# EasyEDA Pro project ProPrj_火车手动控制开关_2025-05-28.epro, board PCB1
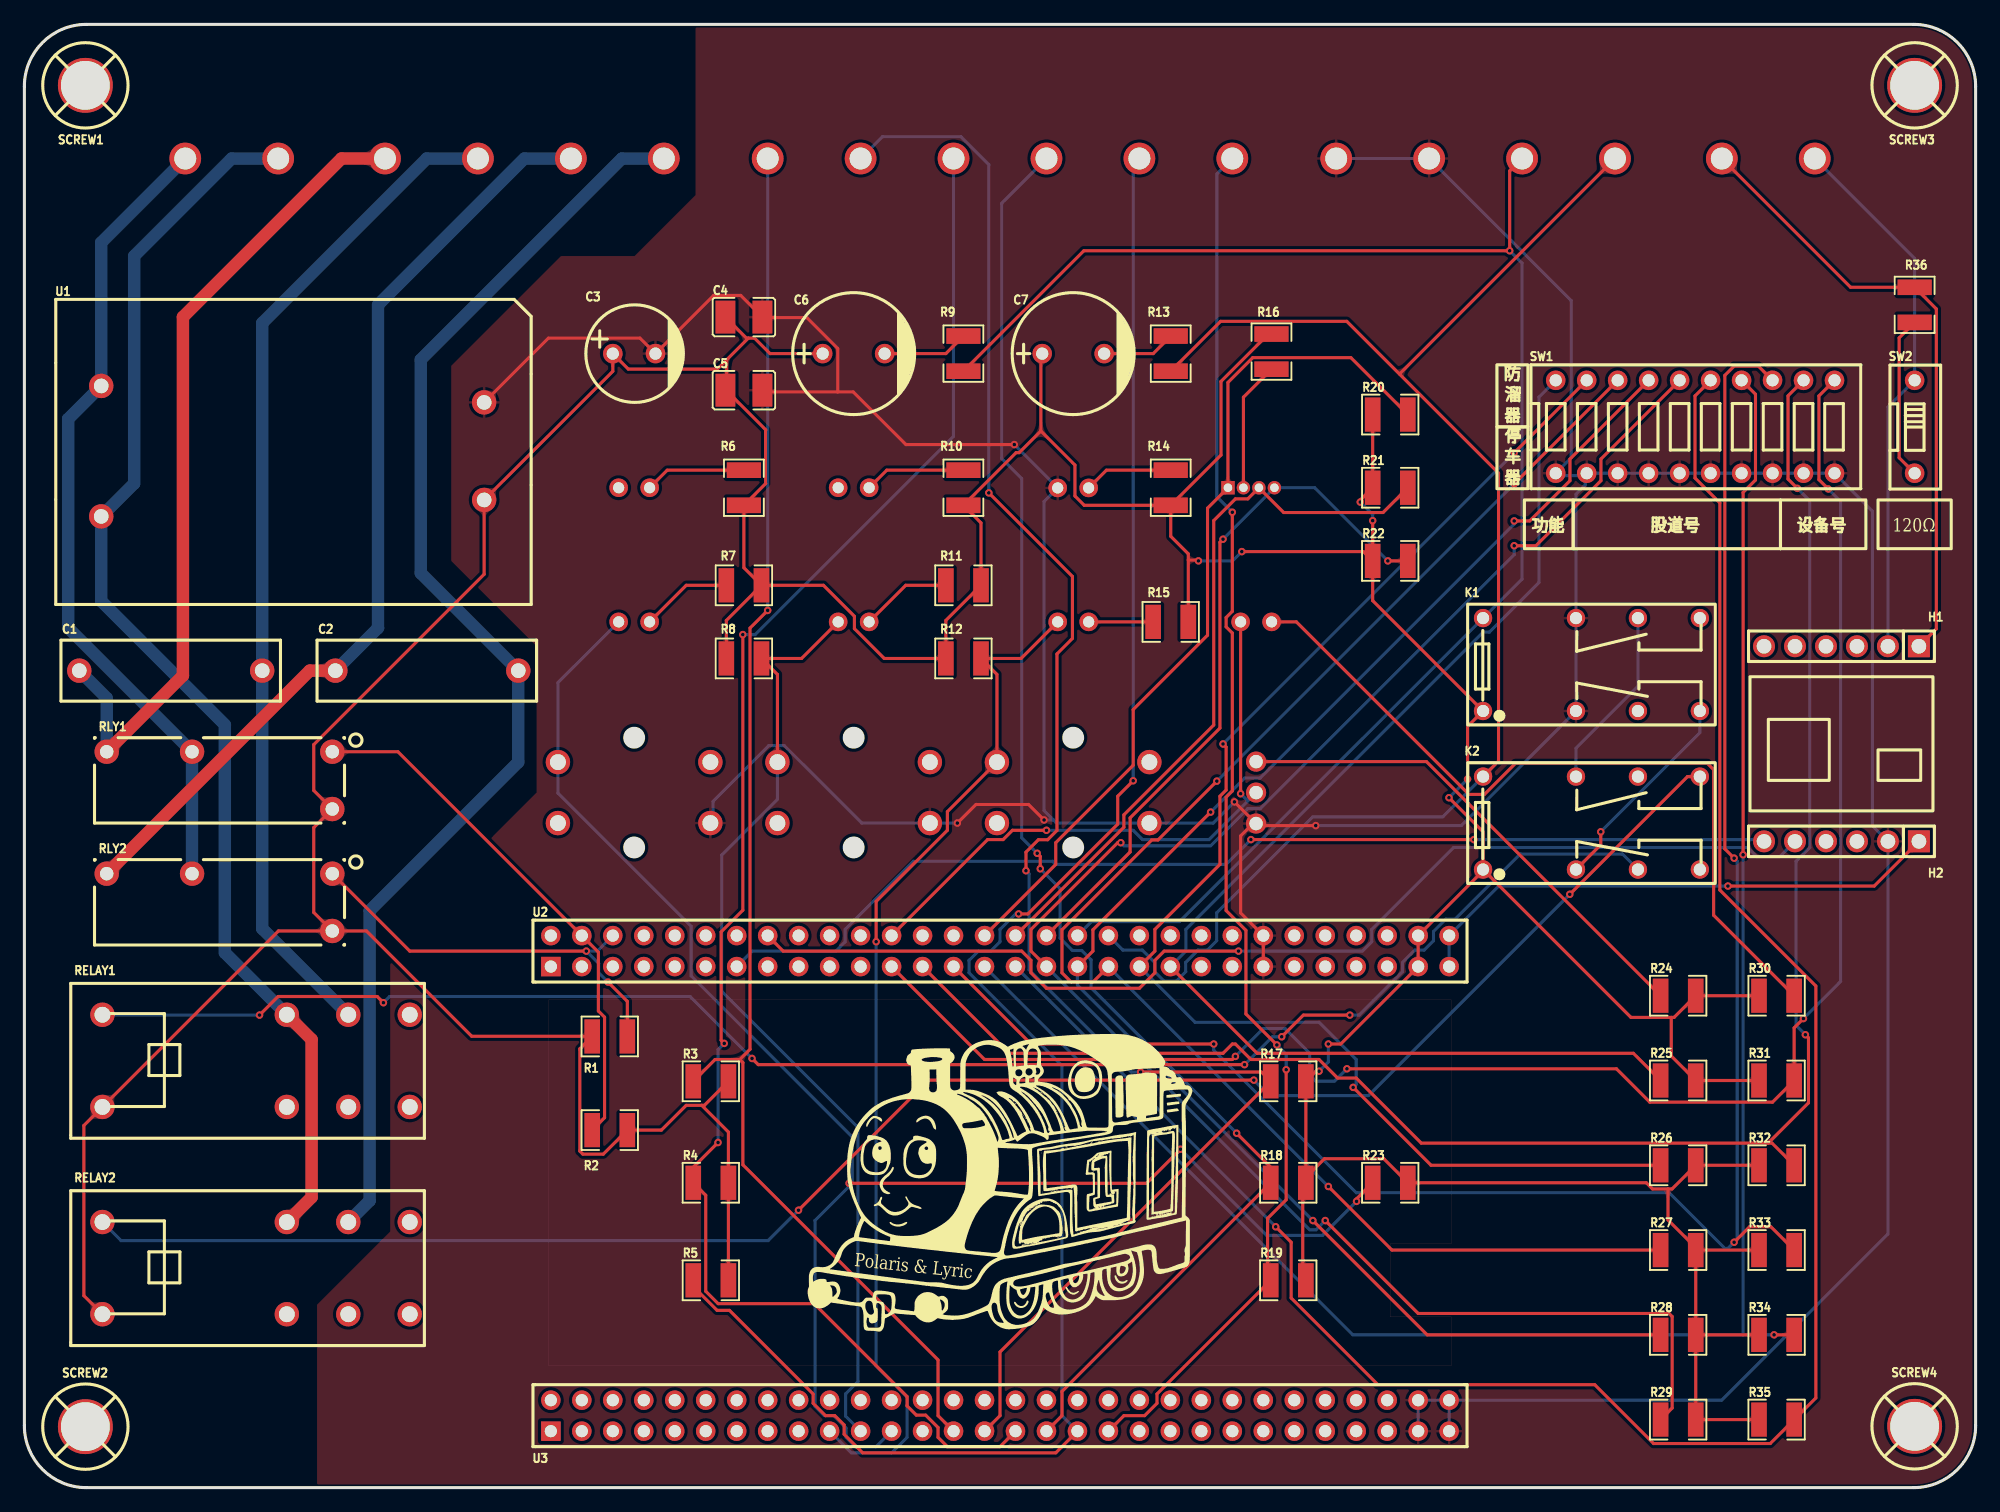
[diagram p3: board, top side]
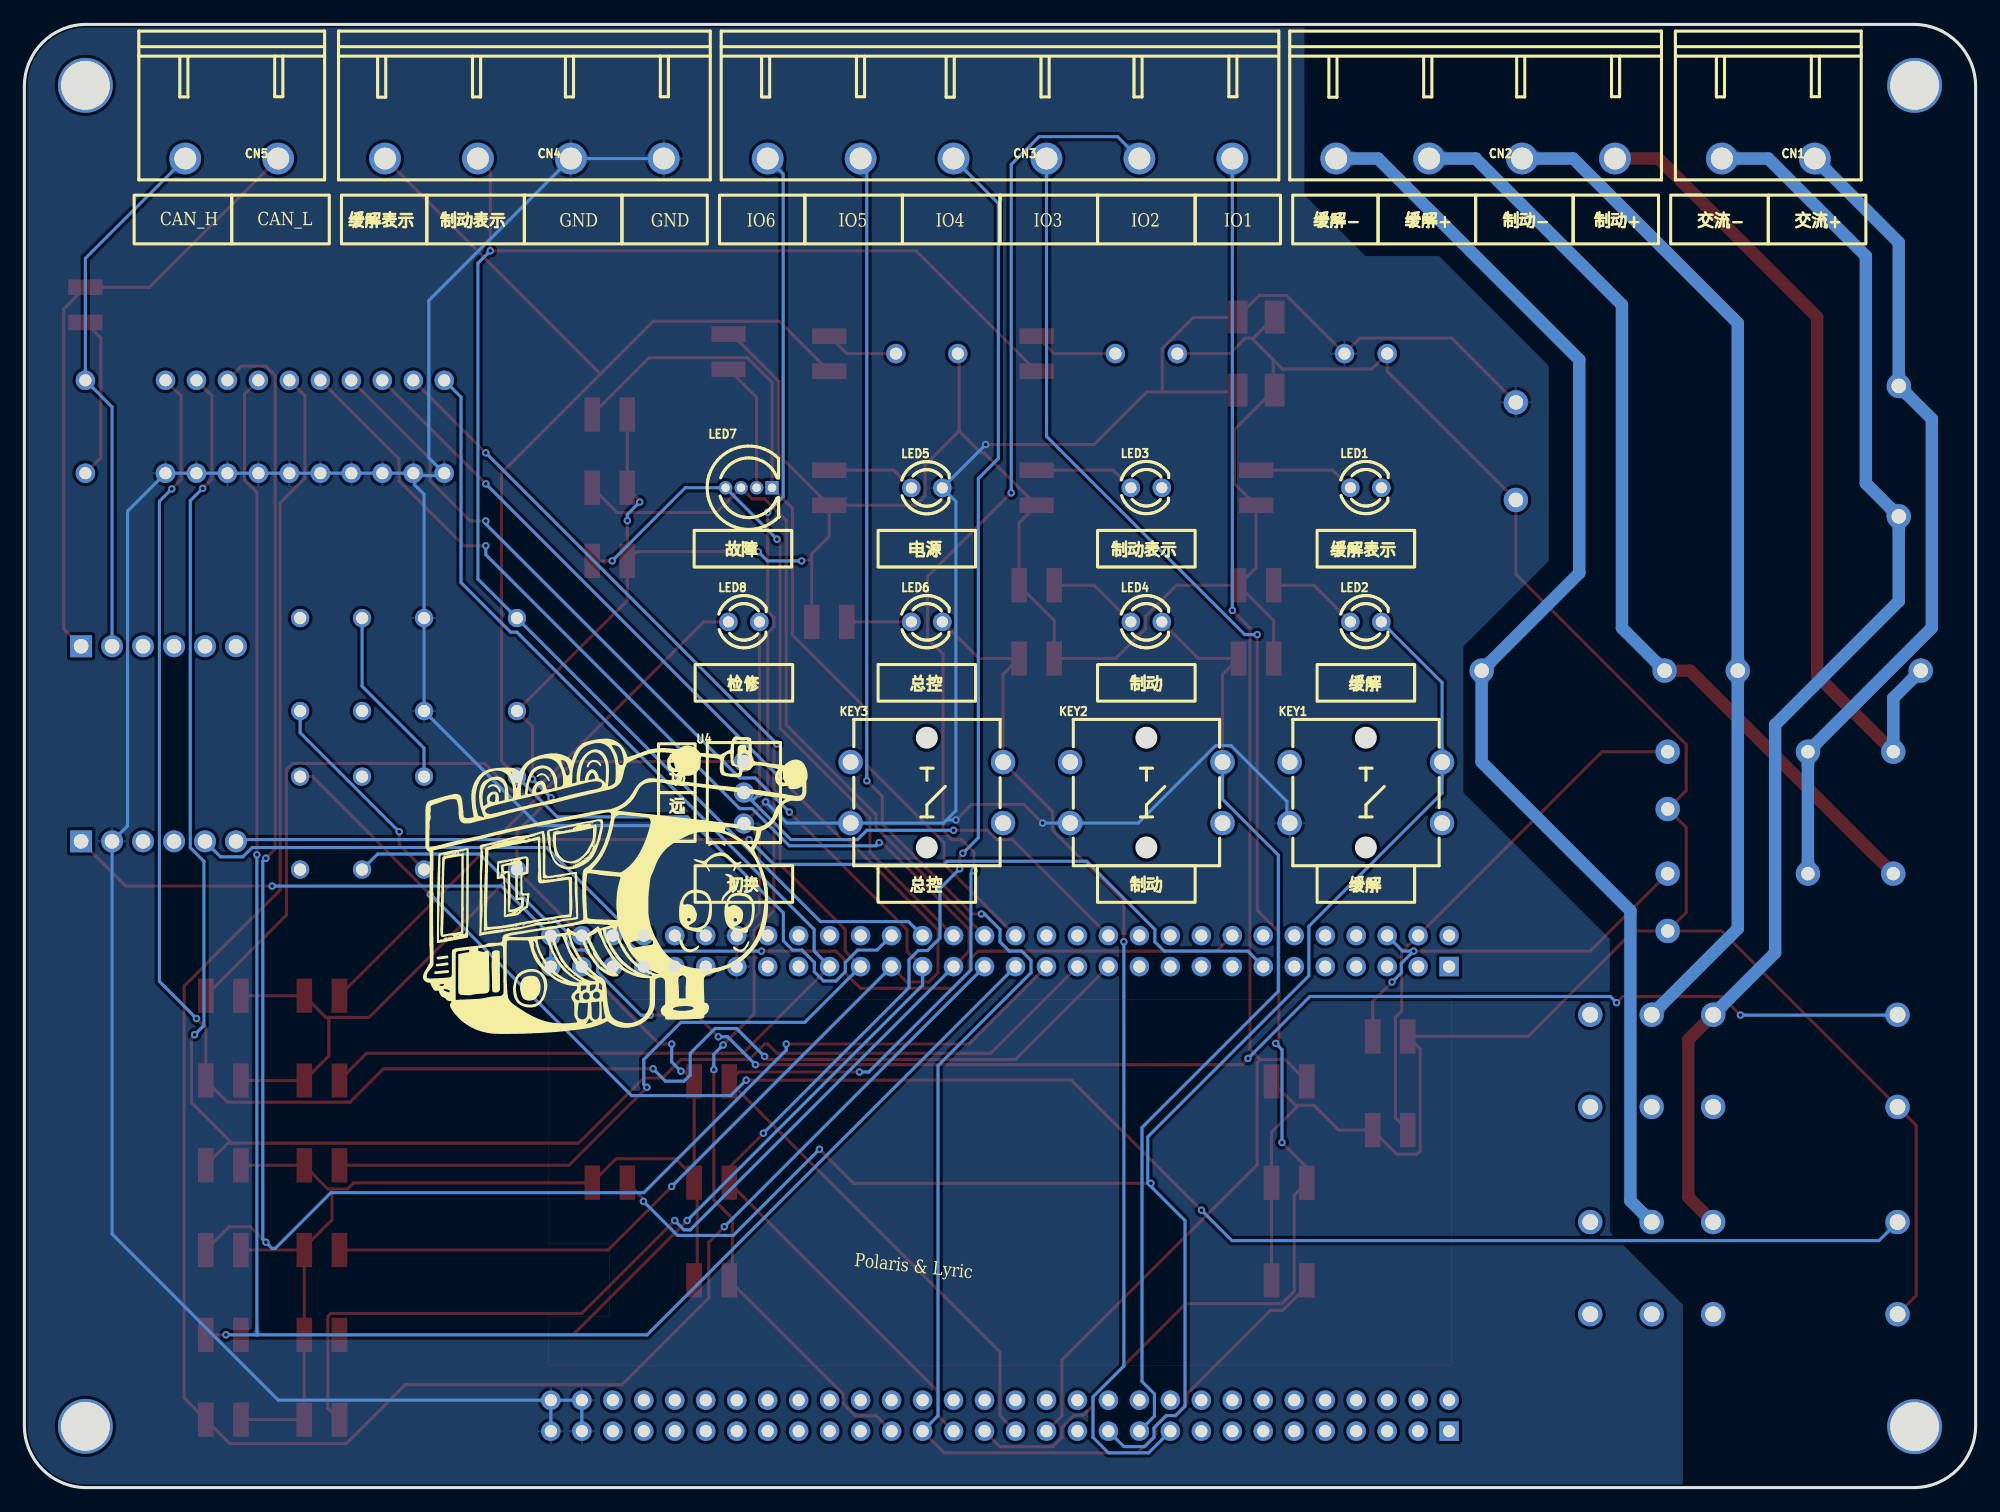
[diagram p4: board, bottom side, seen from below]

Outline 160 x 120 mm; copper layers: Top Layer, Bottom Layer. Coordinates in mm from the lower left corner of the outline.
Outline path: 0,114.92 0,5.08 arc(1.49,1.49) 5.08,0 154.92,0 arc(158.51,1.49) 160,5.08 160,114.92 arc(158.51,118.51) 154.92,120 5.08,120 arc(1.49,118.51) 0,114.92
Stack: Top Layer 0.035mm / Dielectric1 1.51mm FR4 er 4.5 / Bottom Layer 0.035mm

## Design rules (mm)
template: 自定义配置
spacing copperThickness1oz (default): track to track 0.102, other pairs 0.152 to 0.3
spacing copperThickness2oz: track to track 0.203, other pairs 0.152 to 0.3
track width copperThickness1oz (default): min 0.127, default 0.254, max 2.54
track width copperThickness2oz: min 0.203, default 0.254, max 2.54
track width trackWidth1: min 0.508, default 1.016, max 2.54
differential pair differentialPair (default): width min 0.127, default 0.254, max 2.54; gap min 0.152, default 0.152
via viaSize (default): diameter min 0.5, default 0.61, max 10; hole min 0.3, default 0.305, max 6.3
net +5V uses copperThickness2oz
net GND uses copperThickness2oz
net +AC uses copperThickness2oz, trackWidth1
net -AC uses copperThickness2oz, trackWidth1
net +RELIEF uses copperThickness2oz, trackWidth1
net -RELIEF uses copperThickness2oz, trackWidth1
net +BRAKE uses copperThickness2oz, trackWidth1
net -BRAKE uses copperThickness2oz, trackWidth1
net +RELEASE uses copperThickness2oz, trackWidth1
net -RELEASE uses copperThickness2oz, trackWidth1
net +3V3 uses copperThickness2oz

## Placement (name value [footprint] x y rotation side)
C1  47nF  [CAP-TH_L18.0-W5.0-P15.00-D0.8]  12 67 0 top
C2  47nF  [CAP-TH_L18.0-W5.0-P15.00-D0.8]  33 67 0 top
C3  470uF  [CAP-TH_BD8.0-P3.50-D0.6-FD]  50 93 0 top
C4  100nF  [C1210]  59 96 0 top
C5  100nF  [C1210]  59 90 0 top
C6  2200uF  [CAP-TH_BD10.0-P5.00-D1.0-FD]  68 93 0 top
C7  2200uF  [CAP-TH_BD10.0-P5.00-D1.0-FD]  86 93 0 top
CN1  KF2EDGRC-7.62-2P  [CONN-TH_P7.62_KF2EDGRC-7.62-2P]  17 109 0 bottom
CN2  KF2EDGRC-7.62-4P  [CONN-TH_4P-P7.62_KF2EDGRC-7.62-4P]  41 109 0 bottom
CN3  KF2EDGRC-7.62-6P  [CONN-TH_6P-P7.62_KF2EDGRC-7.62-6P]  80 109 0 bottom
CN4  KF2EDGRC-7.62-4P  [CONN-TH_4P-P7.62_KF2EDGRC-7.62-4P]  119 109 0 bottom
CN5  KF2EDGRC-7.62-2P  [CONN-TH_P7.62_KF2EDGRC-7.62-2P]  143 109 0 bottom
H1  2.54-1x6P直针  [HDR-TH_6P-P2.54-V-M-1]  149 69 180 top
H2  2.54-1x6P直针  [HDR-TH_6P-P2.54-V-M-1]  149 53 180 top
K1  HRS2H-S-DC5V-N  [RELAY-TH_HRS2H-S-XX]  128.5 67.5 0 top
K2  HRS2H-S-DC5V-N  [RELAY-TH_HRS2H-S-XX]  128.5 54.5 0 top
KEY1  B3F-4055  [KEY-TH_4P-L12.0-W12.0-P5.00-LS13.4-EH]  50 57 180 bottom
KEY2  B3F-4055  [KEY-TH_4P-L12.0-W12.0-P5.00-LS13.4-EH]  68 57 180 bottom
KEY3  B3F-4055  [KEY-TH_4P-L12.0-W12.0-P5.00-LS13.4-EH]  86 57 180 bottom
LED1  204-10SURD/S530-A3  [LED-TH_BD3.0-P2.54-FD]  50 82 180 bottom
LED2  204-10SURD/S530-A3  [LED-TH_BD3.0-P2.54-FD]  50 71 180 bottom
LED3  204-10SURD/S530-A3  [LED-TH_BD3.0-P2.54-FD]  68 82 180 bottom
LED4  204-10SURD/S530-A3  [LED-TH_BD3.0-P2.54-FD]  68 71 180 bottom
LED5  204-10SURD/S530-A3  [LED-TH_BD3.0-P2.54-FD]  86 81.98 180 bottom
LED6  204-10SURD/S530-A3  [LED-TH_BD3.0-P2.54-FD]  86 71 180 bottom
LED7  MHLA5319URGBDWT  [LED-TH_4P-BD6.9-P1.27-R]  100.6 82 180 bottom
LED8  204-10SURD/S530-A3  [LED-TH_BD3.0-P2.54-FD]  101 71 180 bottom
R1  10kΩ  [R1210]  48 37 180 top
R2  10kΩ  [R1210]  48 29.32 0 top
R3  10kΩ  [R1210]  56.29 33.32 0 top
R4  10kΩ  [R1210]  56.29 25 0 top
R5  10kΩ  [R1210]  56.29 17 0 top
R6  1kΩ  [R1210]  59 82 90 top
R7  1kΩ  [R1210]  59 74 180 top
R8  360Ω  [R1210]  59 68 180 top
R9  360Ω  [R1210]  77 93 90 top
R10  1kΩ  [R1210]  77 82 90 top
R11  1kΩ  [R1210]  77 74 180 top
R12  360Ω  [R1210]  77 68 180 top
R13  360Ω  [R1210]  94 93 90 top
R14  1kΩ  [R1210]  94 82 90 top
R15  1kΩ  [R1210]  94 71 180 top
R16  1kΩ  [R1210]  102.26 93.16 270 top
R17  10kΩ  [R1210]  103.64 33.32 0 top
R18  10kΩ  [R1210]  103.64 25 0 top
R19  10kΩ  [R1210]  103.64 17 0 top
R20  360Ω  [R1210]  112 88 0 top
R21  360Ω  [R1210]  112 82 0 top
R22  360Ω  [R1210]  112 76 0 top
R23  360Ω  [R1210]  112 25 0 top
R24  360Ω  [R1210]  135.61 40.34 0 top
R25  360Ω  [R1210]  135.61 33.39 0 top
R26  360Ω  [R1210]  135.61 26.44 0 top
R27  360Ω  [R1210]  135.61 19.48 0 top
R28  360Ω  [R1210]  135.61 12.53 0 top
R29  360Ω  [R1210]  135.61 5.58 0 top
R30  1kΩ  [R1210]  143.68 40.34 0 top
R31  360Ω  [R1210]  143.68 33.39 0 top
R32  360Ω  [R1210]  143.68 26.44 0 top
R33  360Ω  [R1210]  143.68 19.48 0 top
R34  360Ω  [R1210]  143.68 12.53 0 top
R35  360Ω  [R1210]  143.68 5.58 0 top
R36  120Ω  [R1210]  155 97 90 top
RELAY1  HF115F/005-2ZS4  [RELAY-TH_HF115F-024-2ZS4]  19 35 90 top
RELAY2  HF115F/005-2ZS4  [RELAY-TH_HF115F-024-2ZS4]  19 18 90 top
RLY1  HF46F/5-HS1T  [RELAYS-TH_HF46F-XX-HS1-XXX]  16 58 180 top
RLY2  HF46F/5-HS1T  [RELAYS-TH_HF46F-XX-HS1-XXX]  16 48 180 top
SCREW1  -  [M4螺丝]  5 115 0 top
SCREW2  -  [M4螺丝]  5 5 0 top
SCREW3  -  [M4螺丝]  155 115 0 top
SCREW4  -  [M4螺丝]  155 5.03 0 top
SW1  DS-10RP  [SW-TH_DS-10RP]  137 87 0 top
SW2  DSWB01LHGET  [SW-TH_DSWB01LHGET]  155 87 0 top
U1  TAS10-5-W2  [PWRM-TH_TAS10-XX-W2]  22 85 0 top
U2  ZX-PM2.54-2-30PY  [HDR-TH_60P-P2.54-V-F-R2-C30-S2.54]  80 44 0 top
U3  ZX-PM2.54-2-30PY  [HDR-TH_60P-P2.54-V-F-R2-C30-S2.54]  80 5.9 0 top
U4  SA1-0-102-C02-0000-RS  [SW-TH_SA1-0-102-C02-0000-RS]  101 57 270 bottom

## Footprints (pads in the part's own frame, mm; a bottom-side part is the same pattern mirrored in y, then rotated)
C1210
  rect 1.635x2.7 smd: 1(-1.518,0) 2(1.518,0)
CAP-TH_BD8.0-P3.50-D0.6-FD
  round 1.6 hole 1: 1(-1.75,0) 2(1.75,0)
CAP-TH_BD10.0-P5.00-D1.0-FD
  round 1.6 hole 1: 1(-2.54,0) 2(2.54,0)
CAP-TH_L18.0-W5.0-P15.00-D0.8
  round 2 hole 1.2: 1(-7.5,0) 2(7.5,0)
CONN-TH_4P-P7.62_KF2EDGRC-7.62-4P
  round 2.6 hole 1.8: 1(-11.43,0) 2(-3.81,0) 3(3.81,0) 4(11.43,0)
CONN-TH_6P-P7.62_KF2EDGRC-7.62-6P
  round 2.6 hole 1.8: 1(-19.05,0) 2(-11.43,0) 3(-3.81,0) 4(3.81,0) 5(11.43,0) 6(19.05,0)
CONN-TH_P7.62_KF2EDGRC-7.62-2P
  round 2.6 hole 1.8: 1(-3.81,0) 2(3.81,0)
HDR-TH_6P-P2.54-V-M-1
  rect 1.8x1.8 hole 1.2: 1(-6.35,0)
  round 1.8 hole 1.2: 2(-3.81,0) 3(-1.27,0) 4(1.27,0) 5(3.81,0) 6(6.35,0)
HDR-TH_60P-P2.54-V-F-R2-C30-S2.54
  rect 1.6x1.6 hole 1: 1(-36.83,-1.27)
  round 1.6 hole 1: 2(-36.83,1.27) 3(-34.29,-1.27) 4(-34.29,1.27) 5(-31.75,-1.27) 6(-31.75,1.27) 7(-29.21,-1.27) 8(-29.21,1.27) 9(-26.67,-1.27) 10(-26.67,1.27) 11(-24.13,-1.27) 12(-24.13,1.27) 13(-21.59,-1.27) 14(-21.59,1.27) 15(-19.05,-1.27) 16(-19.05,1.27) 17(-16.51,-1.27) 18(-16.51,1.27) 19(-13.97,-1.27) 20(-13.97,1.27) 21(-11.43,-1.27) 22(-11.43,1.27) 23(-8.89,-1.27) 24(-8.89,1.27) 25(-6.35,-1.27) 26(-6.35,1.27) 27(-3.81,-1.27) 28(-3.81,1.27) 29(-1.27,-1.27) 30(-1.27,1.27) 31(1.27,-1.27) 32(1.27,1.27) 33(3.81,-1.27) 34(3.81,1.27) 35(6.35,-1.27) 36(6.35,1.27) 37(8.89,-1.27) 38(8.89,1.27) 39(11.43,-1.27) 40(11.43,1.27) 41(13.97,-1.27) 42(13.97,1.27) 43(16.51,-1.27) 44(16.51,1.27) 45(19.05,-1.27) 46(19.05,1.27) 47(21.59,-1.27) 48(21.59,1.27) 49(24.13,-1.27) 50(24.13,1.27) 51(26.67,-1.27) 52(26.67,1.27) 53(29.21,-1.27) 54(29.21,1.27) 55(31.75,-1.27) 56(31.75,1.27) 57(34.29,-1.27) 58(34.29,1.27) 59(36.83,-1.27) 60(36.83,1.27)
KEY-TH_4P-L12.0-W12.0-P5.00-LS13.4-EH
  round 2 hole 1.3: 1(6.25,-2.5) 2(-6.25,-2.5) 3(6.25,2.5) 4(-6.25,2.5)
LED-TH_4P-BD6.9-P1.27-R
  rect 1.1x1.1 hole 0.7: 1(1.905,0)
  round 1.1 hole 0.7: 2(0.635,0) 3(-0.635,0) 4(-1.905,0)
LED-TH_BD3.0-P2.54-FD
  round 1.524 hole 0.914: 1(-1.27,0) 2(1.27,0)
M4螺丝
  round 4.5 hole 4: 1(0,0)
PWRM-TH_TAS10-XX-W2
  round 2 hole 1.2: 1(-15.7,-5.35) 2(-15.7,5.35) 4(15.7,4) 6(15.7,-4)
R1210
  rect 1.282x2.808 smd: 1(-1.441,0) 2(1.441,0)
RELAY-TH_HF115F-024-2ZS4
  round 2 hole 1.3: 1(-3.78,12.6) 2(3.78,12.6) 3(-3.78,-2.52) 4(3.78,-2.52) 5(-3.78,-7.56) 6(3.78,-7.56) 7(-3.78,-12.6) 8(3.78,-12.6)
RELAY-TH_HRS2H-S-XX
  round 1.5 hole 1: 1(-8.89,-3.81) 2(-8.89,3.81) 3(-1.27,-3.81) 4(3.81,-3.81) 5(8.89,-3.81) 6(8.89,3.81) 7(3.81,3.81) 8(-1.27,3.81)
RELAYS-TH_HF46F-XX-HS1-XXX
  round 2 hole 1.1: 1(-9.25,-2.35) 2(2.25,-2.35) 3(9.25,-2.35) 6(-9.25,2.35)
SW-TH_DS-10RP
  round 1.6 hole 1: 1(-11.43,-3.81) 2(-8.89,-3.81) 3(-6.35,-3.81) 4(-3.81,-3.81) 5(-1.27,-3.81) 6(1.27,-3.81) 7(3.81,-3.81) 8(6.35,-3.81) 9(8.89,-3.81) 10(11.43,-3.81) 11(11.43,3.81) 12(8.89,3.81) 13(6.35,3.81) 14(3.81,3.81) 15(1.27,3.81) 16(-1.27,3.81) 17(-3.81,3.81) 18(-6.35,3.81) 19(-8.89,3.81) 20(-11.43,3.81)
SW-TH_DSWB01LHGET
  round 1.6 hole 1: 1(0,3.81) 2(0,-3.81)
SW-TH_SA1-0-102-C02-0000-RS
  round 1.65 hole 1.1: 1(-2.54,0) 2(0,0) 3(2.54,0)

## Nets
As in the schematic.

Pads without a net: H1 3 4 5 6; H2 3 4; K1 4 6; K2 5 7; KEY1 1 4; KEY2 1 4; KEY3 1 4; RELAY1 3 5 7 8; RELAY2 3 5 7 8; SCREW1 1; SCREW2 1; SCREW3 1; SCREW4 1; U2 1 2 3 5 7 8 9 10 11 12 14 15 17 18 19 20 21 22 26 28 40 42 43 44 45 46 49 50 51 52 53 54 55 56; U3 1 2 3 4 5 6 7 8 9 10 11 12 13 14 15 16 17 18 20 22 24 25 26 28 30 32 34 36 38 39 40 41 42 43 44 45 46 47 48 49 50 51 52 53 54 55 56

## Via types
v1: diameter 0.61, hole 0.305, Top Layer to Bottom Layer, 77 vias

## Routing (per net, layer and track width the routed paths; a pad name or vN(x,y) marks a point on that pad's centre or on a via; arc(x,y) is an arc through that point)
+3V3: length 44.3
  Top Layer w0.254: v1(139.69,49.33) 151.68,49.33 H2.1
  Bottom Layer w0.254: U2.59 U2.60 120.89,49.33 v1(139.69,49.33)
+5V: length 523.1
  Top Layer w0.254: R7.1 59,75.44 R6.1 60.78,82.34 60.78,86.76 57.59,89.95 ; R7.1 65.52,74 68.06,71.46 68.06,70.44 70.5,68 R12.2 75.56,71.12 R11.1 78.44,79.12 R10.1 81.32,84.88 81.57,84.88 83.35,86.66 ; R7.1 57.56,71.12 R8.2 ; K2.1 119.61,50.59 U2.58 U2.57 107.94,36.38 v1(106.92,36.38) ; K2.1 119.61,53.78 v1(116.82,56.58) ; K2.1 131.74,38.56 135.04,38.56 ; v1(118.34,58.1) 118.34,62.42 K1.1 110.56,72.74 R22.1 ; v1(99.83,76.76) 109.8,76.76 R22.1 ; R33.1 137.07,19.48 137.06,19.49 ; R30.1 R24.2 135.27,38.56 135.04,38.56 ; 95.44,76.07 96.2,76.07 v1(96.27,76) ; 95.44,76.07 R15.1 ; 95.44,76.07 95.44,76.58 94,78.02 R14.1 ; 135.04,38.56 135.04,35.4 R25.2 R31.1 ; 137.06,19.49 R27.2 R28.2 ; 137.06,19.49 137.06,19.67 134.78,21.95 134.78,24.49 ; R22.1 v1(110.56,79.3) ; 55.54,31.35 54.27,31.35 52.23,29.32 R2.2 47.47,27.35 45.8,27.35 45.54,27.6 45.54,35.98 R1.2 46.55,37.01 36.68,37.01 28.04,45.65 RLY2.6 ; 55.54,31.35 55.76,31.35 R3.2 ; 55.54,31.35 57.73,29.16 R4.2 R5.2 ; C7.1 83.35,92.89 83.35,86.66 ; R32.1 R26.2 135.11,24.49 134.78,24.49 ; 59.36,94.27 59.87,94.27 61.14,93 C6.1 ; 59.36,94.27 59.21,94.27 C4.1 ; 59.36,94.27 57.59,92.49 ; R35.1 R29.2 R28.2 ; 57.59,92.49 56.82,91.73 49.52,91.73 C3.1 48.25,91.55 U1.6 37.7,74.9 23.73,60.93 23.73,57.17 RLY1.6 23.73,54.13 23.73,47.17 RLY2.6 ; 57.59,92.49 57.59,89.95 ; 83.35,86.66 86.14,83.86 86.14,81.32 86.91,80.56 R14.1 ; R20.1 R21.1 109.54,80.98 v1(109.54,80.83) ; RLY2.6 20.83,45.65 RELAY1.1 4.88,29.7 4.88,15.74 RELAY2.1 ; R28.2 R34.1 ; 102.26,94.61 102.01,94.61 98.12,90.72 98.12,84.68 R14.1 ; 134.78,24.49 133.51,24.49 133,25 R23.2 111.47,26.97 106.6,26.97 105.08,25.45 ; 105.08,25.45 105.08,25 104.82,24.75 104.82,17.25 105.08,17 ; 105.08,25.45 105.08,33.32 105.91,34.15 v1(106.16,34.15) ; 57.59,89.95 C5.1
  Bottom Layer w0.254: v1(118.34,58.1) v1(116.82,56.58) ; v1(110.56,79.3) 110.56,79.81 v1(109.54,80.83) ; v1(106.16,34.15) 106.92,34.91 v1(106.92,36.38) ; v1(96.27,76) 99.07,76 v1(99.83,76.76)
GND: length 386.5
  Top Layer w0.254: U4.3 100.75,54.46 99.73,53.44 99.73,47.13 U2.48 U2.47 ; U4.3 v1(99.22,56.24) ; U4.3 101.17,54.29 v1(105.89,54.29) ; 66.7,89.86 66.7,93.42 64.16,95.95 60.56,95.95 C4.2 58.74,97.77 56.52,97.77 C3.2 50.48,94.27 42.97,94.27 U1.4 ; 66.7,89.86 60.66,89.86 C5.2 ; 66.7,89.86 67.97,89.86 72.28,85.54 v1(81.17,85.54) ; v1(76.5,54.5) 78.03,56.02 82.34,56.02 v1(83.61,54.75)
  Bottom Layer w0.254: U3.57 U3.58 U3.60 ; 84.38,54.75 84.63,54.5 KEY3.2 97.48,54.5 v1(99.22,56.24) ; 84.38,54.75 83.61,55.52 83.61,80.87 LED5.2 v1(81.17,85.54) ; 84.38,54.75 v1(83.61,54.75) ; 127.99,82.99 127.99,82.23 127.23,81.47 K1.8 K1.3 117.83,54.29 v1(105.89,54.29) ; 127.99,82.99 125.77,82.99 SW1.1 126.84,84.46 126.84,97.35 CN4.2 CN4.1 ; 127.99,82.99 SW1.2 SW1.3 SW1.4 SW1.5 SW1.6 SW1.7 SW1.8 SW1.9 SW1.10 151.54,80.08 151.54,54.27 H2.2 152.81,20.8 139.18,7.17 U3.60 ; KEY1.2 56.47,54.72 56.47,56.28 61.04,60.85 62.31,60.85 68.66,54.5 KEY2.2 v1(76.5,54.5) ; U3.60 U3.59
+AC: length 66.8
  Bottom Layer w1.016: CN1.1 6.3,102.11 U1.2 3.59,87.64 3.59,70.51 RLY1.2 RLY2.2
+BRAKE: length 67.8
  Top Layer w1.016: CN2.1 26,109 13,96 13,66.6 RLY1.3
  Bottom Layer w1.016: RLY1.3 6.75,64.75 C1.1
+RELEASE: length 77.9
  Top Layer w1.016: RLY2.3 23.4,67 C2.1
  Bottom Layer w1.016: C2.1 29,70.5 29,97 41,109 CN2.3
-AC: length 103.4
  Top Layer w1.016: RELAY1.4 23.55,36.75 23.55,23.81 RELAY2.4
  Bottom Layer w1.016: RELAY1.4 16.44,43.86 16.44,62.56 6.3,72.7 U1.1 9,82.35 9,101 17,109 CN1.2
-BRAKE: length 82.9
  Bottom Layer w1.016: CN2.2 33,109 19.5,95.5 C1.2 19.5,45.84 RELAY1.6
-RELEASE: length 106.6
  Bottom Layer w1.016: CN2.4 49,109 32.5,92.5 32.5,75 C2.2 40.5,59.5 28.31,47.31 28.31,23.53 RELAY2.6
BRAKE_BTN: length 78.9
  Top Layer w0.254: LED4.2 63.73,68 R8.1 61.75,66.69 KEY2.3
  Bottom Layer w0.254: KEY2.3 61.75,56.45 57.18,51.88 57.18,40.7 68.35,29.53 68.35,8.7 67.34,7.68 67.34,5.86 U3.21
BRAKE_DISABLE: length 137.9
  Top Layer w0.254: v1(29.44,39.77) 28.93,40.28 20.8,40.28 v1(19.28,38.75) ; v1(59.67,35.2) 60.17,34.69 v1(100.05,34.69) ; v1(103.1,36.97) 104.88,38.75 v1(108.69,38.75)
  Bottom Layer w0.254: v1(59.67,35.2) 54.59,40.28 29.95,40.28 v1(29.44,39.77) ; v1(103.1,36.97) 102.34,36.97 v1(100.05,34.69) ; v1(19.28,38.75) 6.43,38.75 RELAY1.2 ; K2.4 131.04,51.96 122.66,51.96 117.32,46.63 116.56,46.63 115.55,45.61 115.55,44.85 114.78,44.09 114.02,44.09 113.01,43.07 113.01,42.31 109.45,38.75 v1(108.69,38.75)
BRAKE_EN: length 43.8
  Top Layer w0.254: RLY1.1 30.63,60.35 U2.4 47.07,43.91 47.07,39.09 47.58,38.58 47.58,30.34 R2.1
BRAKE_STATUS: length 132.8
  Top Layer w0.254: R9.1 86.88,101.43 v1(121.79,101.43) 121.79,107.98 CN4.3
  Bottom Layer w0.254: U2.36 87.5,46.42 94.72,46.42 K1.2 122.81,74.51 122.81,100.42 v1(121.79,101.43)
CAN_H: length 44.3
  Bottom Layer w0.254: CN5.2 155,100.81 SW2.1 152.81,88.62 H1.2
CAN_L: length 51
  Top Layer w0.254: H1.1 156.78,70.43 156.78,96.66 R36.2 149.75,98.44 CN5.1
CTRL_BTN: length 84.7
  Top Layer w0.254: LED6.2 81.73,68 R12.1 79.75,66.69 KEY3.3 75.69,55.44 75.69,53.91 69.84,48.07 v1(69.84,44.77)
  Bottom Layer w0.254: U3.19 67.81,2.85 71.11,2.85 72.38,4.12 72.38,7.44 69.84,9.97 v1(69.84,44.77)
DEVICE_ID0: length 143.6
  Top Layer w0.254: v1(147.91,81.9) 147.15,82.66 147.15,89.53 SW1.11 ; U2.23 78.73,35.11 99.05,35.11 v1(99.3,35.36) ; v1(108.45,34.35) 130.55,34.35 133.28,31.61 143.34,31.61 R31.2 145.12,37.71 v1(145.88,38.47)
  Bottom Layer w0.254: v1(145.88,38.47) 148.93,41.52 148.93,80.89 v1(147.91,81.9) ; v1(99.3,35.36) 101.59,37.65 103.37,37.65 105.4,35.62 105.4,33.84 105.91,33.33 107.43,33.33 v1(108.45,34.35)
DEVICE_ID1: length 144.9
  Top Layer w0.254: v1(146.04,37.14) 146.29,36.89 146.29,31.55 142.99,28.25 ; R32.2 143.3,28.25 142.99,28.25 ; U2.25 80.76,35.62 98.29,35.62 99.05,36.38 99.3,36.38 100.57,35.11 106.16,35.11 107.69,33.59 109.21,33.59 114.54,28.25 142.99,28.25 ; SW1.12 144.62,89.54 144.62,82.71 v1(145.38,81.95)
  Bottom Layer w0.254: v1(146.04,37.14) 145.28,37.9 145.28,51.37 146.4,52.49 146.4,80.93 v1(145.38,81.95)
FUNC_SEL: length 105.5
  Top Layer w0.254: R25.1 131.94,35.62 101.08,35.62 U2.41
  Bottom Layer w0.254: U2.41 95.24,44 95.24,45.78 119.62,70.16 120.13,70.16 124.2,74.23 124.2,89.44 SW1.20
IO1: length 117.1
  Top Layer w0.254: 58.66,35.11 58.92,34.86 58.92,26.47 74.92,10.47 74.92,5.9 U3.27 ; 58.66,35.11 59.5,35.95 59.5,70.49 v1(60.95,71.94) ; 58.66,35.11 56.64,35.11 R3.1
  Bottom Layer w0.254: v1(60.95,71.94) CN3.1
IO2: length 145.2
  Top Layer w0.254: v1(91.53,34.08) 101.43,34.08 R17.1 80,11.12 80,5.9 U3.29 ; v1(79.08,81.58) 85.94,74.72 85.94,69.64 84.67,68.37 84.67,53.89 83.91,53.13 83.15,53.13 82.13,52.12 v1(82.13,50.59)
  Bottom Layer w0.254: CN3.2 70.36,110.79 76.8,110.79 79.08,108.5 v1(79.08,81.58) ; v1(82.13,50.59) 82.38,50.34 82.38,42.46 90.77,34.08 v1(91.53,34.08)
IO3: length 135.1
  Top Layer w0.254: U3.31 80,3.36 75.68,3.36 74.92,4.12 74.92,4.93 73.9,5.94 73.14,5.94 72.38,6.7 72.38,7.47 64.76,15.09 56.89,15.09 55.87,16.1 55.87,23.98 R4.1 54.85,26.27 v1(56.88,28.3) ; v1(57.39,36.43) 57.13,36.68 57.13,45.57 58.91,47.35 v1(58.91,69.96)
  Bottom Layer w0.254: v1(57.39,36.43) 56.88,35.92 v1(56.88,28.3) ; CN3.3 76.18,86.21 59.93,69.96 v1(58.91,69.96)
IO4: length 123.1
  Top Layer w0.254: v1(83.05,52.02) 83.3,51.77 v1(83.3,50.75) ; U3.33 85.08,5.9 85.08,7.88 R18.1 102.2,26.27 v1(99.4,29.06)
  Bottom Layer w0.254: v1(83.3,50.75) 84.92,49.13 84.92,45.07 85.94,44.05 86.7,44.05 87.46,43.29 87.46,41 v1(99.4,29.06) ; v1(83.05,52.02) 81.78,53.29 81.78,82.76 80.14,84.4 80.14,105.33 CN3.4
IO5: length 154.3
  Top Layer w0.254: v1(81.52,47.05) 82.29,47.05 89.65,54.41 89.65,56.7 v1(90.92,57.97) ; U3.35 84.57,2.85 68.74,2.85 67.22,4.38 67.22,5.14 66.45,5.9 65.69,5.9 64.68,6.92 64.68,7.68 57.82,14.54 56.8,14.54 54.85,16.49 R5.1
  Bottom Layer w0.254: U3.35 85.08,5.9 85.08,34.6 77.46,42.22 77.46,43.24 78.22,44 79.24,44 80,44.76 80,45.78 81.27,47.05 v1(81.52,47.05) ; CN3.5 90.92,108.49 v1(90.92,57.97)
IO6: length 115.3
  Top Layer w0.254: v1(103.47,34.27) 103.47,23.6 101.94,22.08 101.94,17.25 R19.1 92.87,7.68 92.87,6.92 91.86,5.9 90.16,5.9 U3.37 ; v1(99.05,79.99) 99.05,71.86 98.54,71.36 98.54,70.59 99.05,70.09 99.05,57.13 98.54,56.62 98.54,47.32 100.16,45.7 100.16,38.84 v1(102.7,36.3)
  Bottom Layer w0.254: CN3.6 97.78,107.73 97.78,81.26 v1(99.05,79.99) ; v1(102.7,36.3) 103.47,35.54 v1(103.47,34.27)
LED_B: length 57.9
  Top Layer w0.254: U2.34 90.67,52.13 90.67,54.92 98.03,62.29 98.03,77.53 v1(98.29,77.78) ; v1(111.8,76) R22.2
  Bottom Layer w0.254: v1(98.29,77.78) LED7.4 105.8,82 v1(111.8,76)
LED_G: length 59.5
  Top Layer w0.254: U2.32 90.16,54.16 90.16,55.18 97.53,62.54 97.53,79.31 99.31,81.09 100.32,81.09 LED7.3 103.26,79.97 111.41,79.97 R21.2
LED_R: length 71.2
  Top Layer w0.254: U2.30 84.57,51.11 84.57,52.89 90.92,59.24 90.92,63.81 97.02,69.91 97.02,80.33 LED7.1 98.69,90.64 100.72,92.67 108.77,92.67 R20.2
PA7: length 114.7
  Top Layer w0.254: v1(122.16,84.86) SW1.19 ; v1(108.96,32.82) 115.34,26.44 R26.1 ; U2.39 92.7,44 92.7,45.78 98.03,51.11 98.03,56.7 98.54,57.21 98.54,60.73 v1(98.29,60.99)
  Bottom Layer w0.254: U2.39 96,38.16 106.16,38.16 109.21,35.11 109.21,33.08 v1(108.96,32.82) ; v1(98.29,60.99) v1(122.16,84.86)
PB0: length 125.6
  Top Layer w0.254: R13.1 98.09,95.65 108.43,95.65 120.88,83.2 120.88,59.58 K2.2 ; 112.76,91.33 CN4.4
  Bottom Layer w0.254: U2.38 90.07,44.09 91.67,44.09 92.69,43.07 92.69,42.31 93.45,41.55 94.46,41.55 95.23,42.31 95.23,43.07 96.24,44.09 97,44.09 97.77,44.85 97.77,47.13 105.64,55.01 116.31,55.01 K2.2
PB1: length 130.2
  Top Layer w0.254: U2.35 87.62,44 87.62,45.75 v1(97.27,55.4) ; v1(122.16,79.28) 123.43,79.28 126.74,82.58 126.74,84.36 SW1.17 ; R28.1 115.03,12.53 v1(105.65,21.9)
  Bottom Layer w0.254: v1(97.27,55.4) 100.07,58.19 101.34,58.19 122.16,79.02 v1(122.16,79.28) ; U2.35 86.35,41.21 v1(105.65,21.9)
PB14: length 93.4
  Top Layer w0.254: U2.16 62.22,44 81.78,44 82.54,43.24 82.54,42.22 83.81,40.95 91.43,40.95 92.7,42.22 92.7,43.24 93.46,44 v1(99.56,44)
  Bottom Layer w0.254: H2.5 143.92,51.73 142.09,51.73 141.32,52.49 117.19,52.49 110.48,45.78 110.48,44.76 109.72,44 v1(99.56,44)
PB15: length 89.4
  Top Layer w0.254: v1(100.57,53.14) v1(118.86,53.14)
  Bottom Layer w0.254: v1(118.86,53.14) 142.51,53.14 H2.6 ; U2.13 59.68,44 66.54,44 67.3,44.76 67.3,45.78 72.89,51.37 84.32,51.37 84.57,51.11 98.54,51.11 v1(100.57,53.14)
PC5: length 127.3
  Top Layer w0.254: v1(97.78,57.94) 92.95,53.11 92.45,53.11 85.08,45.75 85.08,42.22 85.84,41.46 87.62,41.46 U2.37 ; v1(106.92,24.7) 112.14,19.48 R27.1 ; v1(122.16,82.32) SW1.18
  Bottom Layer w0.254: v1(97.78,57.94) v1(122.16,82.32) ; U2.37 v1(106.92,24.7)
PD6: length 135.5
  Top Layer w0.254: v1(67.63,24.96) 92.01,24.96 v1(94.8,27.75) ; R23.1 109.24,23.68 v1(109.24,23.48)
  Bottom Layer w0.254: 67.88,24.96 v1(67.63,24.96) ; 67.88,24.96 67.88,28.77 54.67,41.97 54.67,46.04 43.75,56.96 KEY1.3 43.75,66.02 LED2.2 ; 67.88,24.96 64.83,21.91 64.83,6.67 65.59,5.91 66.36,5.91 67.38,4.88 67.38,4.12 68.14,3.36 69.84,3.36 U3.23 ; v1(109.24,23.48) 106.44,20.68 101.87,20.68 v1(94.8,27.75)
PE10: length 50.4
  Top Layer w0.254: v1(83.81,53.91) 81.02,53.91 80.25,53.14 78.98,53.14 U2.24 ; v1(99.73,56.91) LED8.2
  Bottom Layer w0.254: v1(99.73,56.91) 100.19,56.45 100.45,56.45 ; 100.45,56.45 U4.2 ; 100.45,56.45 97.14,53.14 91.68,53.14 90.92,53.91 v1(83.81,53.91)
PF8: length 34.5
  Top Layer w0.254: v1(47.86,41.46) 49.44,39.87 R1.1 ; v1(46.08,44) 31.6,44 RLY2.1
  Bottom Layer w0.254: U2.6 46.98,44 v1(46.08,44) 47.09,42.98 47.09,42.22 v1(47.86,41.46)
PF11: length 149.8
  Top Layer w0.254: v1(89.91,52.89) 89.65,52.89 82.54,45.78 82.54,44 U2.33 ; v1(122.16,77.24) 123.94,77.24 129.28,82.58 129.28,84.36 SW1.16 ; v1(106.67,21.9) 114.29,14.28 134.86,14.28 135.12,14.03 135.12,6.53 R29.1
  Bottom Layer w0.254: U2.33 105.4,21.14 105.91,21.14 v1(106.67,21.9) ; v1(89.91,52.89) 90.16,52.64 97.27,52.64 100.32,55.68 101.34,55.68 122.16,76.51 v1(122.16,77.24)
PF13: length 174.1
  Top Layer w0.254: v1(102.61,21.39) 103.88,20.12 103.88,15.55 110.99,8.44 128.77,8.44 133.59,3.61 143.16,3.61 R35.2 146.9,7.36 146.9,41.14 139.03,49.01 139.03,80.76 136.99,82.79 136.99,89.53 SW1.15
  Bottom Layer w0.254: U2.31 v1(102.61,21.39)
PF15: length 158.1
  Top Layer w0.254: v1(140.93,51.9) 140.93,81.62 141.95,82.63 141.95,89.67 SW1.14 ; v1(143.47,12.53) R34.2
  Bottom Layer w0.254: 140.93,12.53 v1(143.47,12.53) ; 140.93,12.53 108.93,12.53 U2.29 ; 140.93,12.53 v1(140.93,51.9)
PG1: length 156.7
  Top Layer w0.254: v1(140.2,51.62) 139.44,52.38 139.44,91.21 140.2,91.98 142.18,91.98 SW1.13 ; v1(140.2,20.12) 141.47,21.39 143.21,21.39 R33.2 ; v1(97.53,36.38) 82.54,36.38 U2.27
  Bottom Layer w0.254: v1(140.2,51.62) 140.45,51.37 140.45,20.38 v1(140.2,20.12) 139.69,19.62 139.44,19.62 134.86,24.19 109.21,24.19 97.53,35.87 v1(97.53,36.38)
RELEASE_DISABLE: length 148.4
  Top Layer w0.254: v1(63.48,22.75) 74.14,33.42 v1(100.81,33.42) ; K2.6 136.37,58.31 v1(126.72,48.66)
  Bottom Layer w0.254: v1(63.48,22.75) 60.98,20.26 7.92,20.26 RELAY2.2 ; v1(100.81,33.42) 102.08,32.15 110.21,32.15 v1(126.72,48.66)
$1N6666: length 17.2
  Top Layer w0.254: K2.3 129.26,52.72 v1(129.26,53.78)
  Bottom Layer w0.254: v1(129.26,53.78) 137.39,61.91 K1.5
$1N6674: length 15.1
  Bottom Layer w0.254: K1.7 132.31,65.72 127.23,60.64 K2.8
$1N37726: length 7.1
  Top Layer w0.254: C6.2 75.56,93 R9.2
$1N37765: length 6.1
  Top Layer w0.254: C7.2 92.56,93 R13.2
$1N43438: length 13.4
  Top Layer w0.254: SW2.2 153.73,84.46 153.73,94.29 R36.1
$1N46433: length 41.1
  Top Layer w0.254: U4.1 114.97,59.54 R24.1
$2N2785: length 7.5
  Top Layer w0.254: LED2.1 54.27,74 R7.2
$2N2786: length 7.5
  Top Layer w0.254: R11.2 72.27,74 LED4.1
$2N2787: length 5.3
  Top Layer w0.254: R15.2 LED6.1
$2N2791: length 8.3
  Top Layer w0.254: R10.2 70.71,83.44 LED3.1
$2N2794: length 8.3
  Top Layer w0.254: LED1.1 52.71,83.44 R6.2
$2N2795: length 7.3
  Top Layer w0.254: LED5.1 88.73,83.44 R14.2
$2N4277: length 64.6
  Top Layer w0.254: R30.2 138.52,46.94 138.52,58.88 138.01,59.39 122.26,59.39 119.72,56.85 118.45,56.85 104.3,71 LED8.1
$2N10665: length 10.7
  Top Layer w0.254: LED7.2 99.96,89.42 R16.2

## Copper pours and planes (outline as drawn; the poured copper is in the pictures)
GND on Top Layer: 55.04,120 55.04,106 50.04,101 44,101 35,92 35,76 42,69 42,57 30,45 30,21 24,15 24,0 160,0 160,120
GND on Bottom Layer: 55.04,120 55.04,106 50.04,101 44,101 35,92 35,76 42,69 42,57 30,45 30,21 24,15 24,0 160,0 160,120

Small or netless copper shapes (teardrops, artwork), in the pictures only: 290 on Top Layer, 181 on Bottom Layer

## Text on the board
Bottom Silkscreen Layer: Polaris & Lyric | 交流+ | 交流- | 制动+ | 制动- | 缓解+ | 缓解 | 缓解表示 | 缓解- | IO1 | IO2 | 制动 | 制动表示 | IO3 | IO4 | 总控 | 电源 | IO5 | IO6 | 检修 | 切换 | 故障 | 现 / 场 | 远 / 程 | GND | CAN_L | CAN_H
Top Silkscreen Layer: Polaris & Lyric | 防 / 溜 / 器 | 停 / 车 / 器 | 功能 | 股道号 | 设备号 | 120Ω
